# EAGLE schematic SimuRain_v2.2_Leonardo (EAGLE 9.2.2)
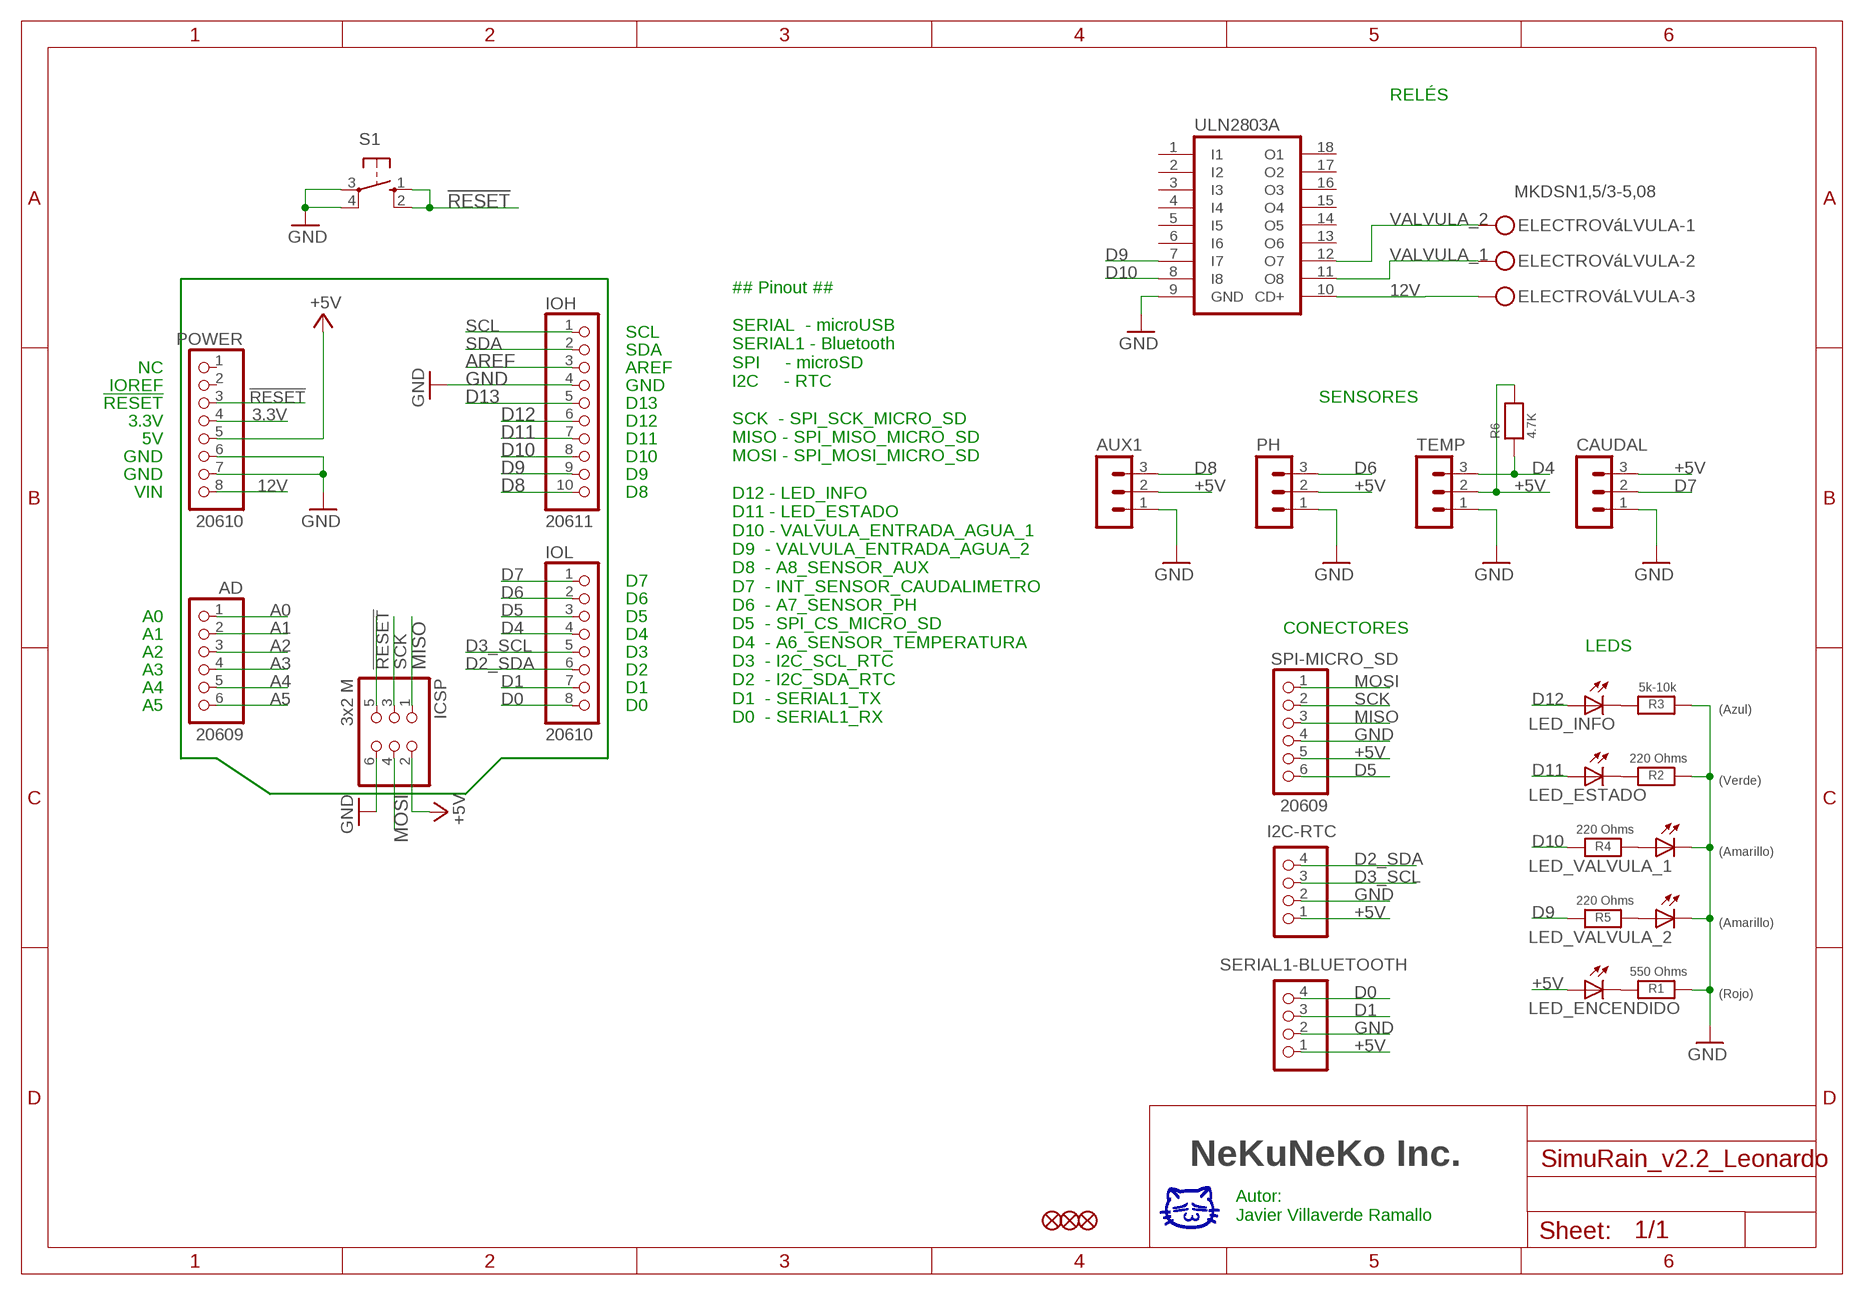
[diagram p0: schematic, sheet 1]

## Parts
AD  20609  HEADER-1X6OVALWAVE  [1X06_OVALWAVE]
AUX1  MA03-1  [MA03-1]
CAUDAL  MA03-1  [MA03-1]
ELECTROVáLVULA  MKDSN1,5/3-5,08  [MKDSN1,5/3-5,08]
FD1  FIDUCIAL_1MM  [FIDUCIAL_1MM]
FD2  FIDUCIAL_1MM  [FIDUCIAL_1MM]
FD3  FIDUCIAL_1MM  [FIDUCIAL_1MM]
I2C-RTC  HEADER-1X4  [1X04_OVAL]
ICSP  3x2 M  HEADER-2X3  [2X03_ROUND_70MIL]
IOH  20611  HEADER-1X10OVALWAVE  [1X10_OVALWAVE]
IOL  20610  HEADER-1X8OVALWAVE  [1X08_OVALWAVE]
LED_ENCENDIDO  LED5MM  [LED5MM]
LED_ESTADO  LED5MM  [LED5MM]
LED_INFO  LED5MM  [LED5MM]
LED_VALVULA_1  LED5MM  [LED5MM]
LED_VALVULA_2  LED5MM  [LED5MM]
PH  MA03-1  [MA03-1]
POWER  20610  HEADER-1X8OVALWAVE  [1X08_OVALWAVE]
R1  550 Ohms  RESISTOR_0805  [_0805]
R2  220 Ohms  RESISTOR_0805  [_0805]
R3  5k-10k  RESISTOR_0805  [_0805]
R4  220 Ohms  RESISTOR_0805  [_0805]
R5  220 Ohms  RESISTOR_0805  [_0805]
R6  4.7K  RESISTOR_0805  [_0805]
S1  10-XX  [B3F-10XX]
SERIAL1-BLUETOOTH  HEADER-1X4  [1X04_OVAL]
SPI-MICRO_SD  20609  HEADER-1X6OVALWAVE  [1X06_OVALWAVE]
TEMP  MA03-1  [MA03-1]
ULN2803A  ULN2803A  [DIL18]

## Nets
3.3V: POWER.4
12V: ELECTROVáLVULA.3 POWER.8 ULN2803A.10(CD+)
!RESET: ICSP.5 POWER.3 S1.1(S) S1.2(S1)
+5V [usbvcc]: AUX1.2 CAUDAL.3 I2C-RTC.1 ICSP.2 LED_ENCENDIDO.A PH.2 POWER.5 R6.2 SERIAL1-BLUETOOTH.1 SPI-MICRO_SD.5 TEMP.2
A0: AD.1
A1: AD.2
A2: AD.3
A3: AD.4
A4: AD.5
A5: AD.6
AREF [aref]: IOH.3
D0: IOL.8 SERIAL1-BLUETOOTH.4
D1: IOL.7 SERIAL1-BLUETOOTH.3
D2_SDA: I2C-RTC.4 IOL.6
D3_SCL: I2C-RTC.3 IOL.5
D4: IOL.4 R6.1 TEMP.3
D5: IOL.3 SPI-MICRO_SD.6
D6: IOL.2 PH.3
D7: CAUDAL.2 IOL.1
D8: AUX1.3 IOH.10
D9: IOH.9 R5.1 ULN2803A.7(I7)
D10: IOH.8 R4.1 ULN2803A.8(I8)
D11: IOH.7 LED_ESTADO.A
D12: IOH.6 LED_INFO.A
D13: IOH.5
GND [gnd]: AUX1.1 CAUDAL.1 I2C-RTC.2 ICSP.6 IOH.4 LED_VALVULA_1.K(C) LED_VALVULA_2.K(C) PH.1 POWER.6 POWER.7 R1.2 R2.2 R3.2 S1.3(P) S1.4(P1) SERIAL1-BLUETOOTH.2 SPI-MICRO_SD.4 TEMP.1 ULN2803A.9(GND)
MISO: ICSP.1 SPI-MICRO_SD.3
MOSI: ICSP.4 SPI-MICRO_SD.1
N$1: LED_VALVULA_2.A R5.2
N$2: LED_VALVULA_1.A R4.2
N$3: LED_ENCENDIDO.K(C) R1.1
N$4: LED_ESTADO.K(C) R2.1
N$5: LED_INFO.K(C) R3.1
SCK: ICSP.3 SPI-MICRO_SD.2
SCL: IOH.1
SDA: IOH.2
VALVULA_1: ELECTROVáLVULA.2 ULN2803A.11(O8)
VALVULA_2: ELECTROVáLVULA.1 ULN2803A.12(O7)
Unconnected: POWER.1 POWER.2 ULN2803A.1(I1) ULN2803A.2(I2) ULN2803A.3(I3) ULN2803A.4(I4) ULN2803A.5(I5) ULN2803A.6(I6) ULN2803A.13(O6) ULN2803A.14(O5) ULN2803A.15(O4) ULN2803A.16(O3) ULN2803A.17(O2) ULN2803A.18(O1)

## Notes on the sheet
- RELÉS
- SCL
- SDA
- NC | AREF
- IOREF | GND
- !RESET | D13 | SENSORES
- 3.3V | D12
- 5V | D11
- GND | D10
- GND | D9
- VIN | D8
- D7
- D6
- A0 | D5
- A1 | D4 | CONECTORES
- A2 | D3 | LEDS
- A3 | D2
- A4 | D1
- A5 | D0
- (Azul)
- ## Pinout ##
  
  SERIAL  - microUSB
  SERIAL1 - Bluetooth
  SPI     - microSD
  I2C     - RTC
  
  SCK  - SPI_SCK_MICRO_SD
  MISO - SPI_MISO_MICRO_SD
  MOSI - SPI_MOSI_MICRO_SD
  
  D12 - LED_INFO
  D11 - LED_ESTADO
  D10 - VALVULA_ENTRADA_AGUA_1
  D9  - VALVULA_ENTRADA_AGUA_2
  D8  - A8_SENSOR_AUX
  D7  - INT_SENSOR_CAUDALIMETRO
  D6  - A7_SENSOR_PH
  D5  - SPI_CS_MICRO_SD
  D4  - A6_SENSOR_TEMPERATURA
  D3  - I2C_SCL_RTC
  D2  - I2C_SDA_RTC
  D1  - SERIAL1_TX
  D0  - SERIAL1_RX
- (Verde)
- (Amarillo)
- (Amarillo)
- (Rojo)
- NeKuNeKo Inc.
- Autor:
  Javier Villaverde Ramallo

## Library data of the parts
AD SPI-MICRO_SD = microbuilder:HEADER-1X6: PIN HEADER
AUX1 CAUDAL PH TEMP = con-lstb:MA03-1: PIN HEADER; OC_FARNELL: unknown; OC_NEWARK: unknown
ELECTROVáLVULA = con-phoenix-508:MKDSN1,5/3-5,08: MKDSN 1,5/ 3-5,08 Printklemme Nennstrom: 13,5 A Nennspannung: 250 V Rastermaß: 5,08 mm Polzahl: 3 Anschlussart: Schraubanschluss Montage: Löten Anschlussrichtung Leiter/Platine: 0 ° Artikelnummer: 1729131 Source: http://eshop.phoenixcontact.com .. 1729131.pdf
FD1-FD3 = microbuilder:FIDUCIAL: Fiducial Alignment Points Various fiducial points for machine vision alignment.; BOM: EXCLUDE
I2C-RTC SERIAL1-BLUETOOTH = microbuilder:HEADER-1X4: PIN HEADER
ICSP = microbuilder:HEADER-2X3: PIN HEADER
IOH = microbuilder:HEADER-1X10: PIN HEADER
IOL POWER = microbuilder:HEADER-1X8: PIN HEADER
LED_ENCENDIDO LED_ESTADO LED_INFO LED_VALVULA_1 LED_VALVULA_2 = led:LED: LED OSRAM: - CHIPLED LG R971, LG N971, LY N971, LG Q971, LY Q971, LO R971, LY R971 LH N974, LH R974 LS Q976, LO Q976, LY Q976 LO Q996 - Hyper CHIPLED LW Q18S LB Q993, LB Q99A, LB R99A - SideLED LS A670, LO A670, LY A670, LG A670, LP A670 LB A673, LV A673, LT A673, LW A673 LH A674 LY A675 LS A676, LA A676, LO A676, LY A676, LW A676 LS A679, LY A679, LG A679 - Hyper Micro SIDELED® LS Y876, LA Y876, LO Y876, LY Y876 LT Y87S - SmartLED LW L88C, LW L88S LB L89C, LB L89S, LG L890 LS L89K, LO L89K, LY L89K LS L896, LA L896, LO L896, LY L896 - TOPLED LS T670, LO T670, LY T670, LG T670, LP T670 LSG T670, LSP T670, LSY T670, LOP T670, LYG T670 LG T671, LOG T671, LSG T671 LB T673, LV T673, LT T673, LW T673 LH T674 LS T676, LA T676, LO T676, LY T676, LB T676, LH T676, LSB T676, LW T676 LB T67C, LV T67C, LT T67C, LS T67K, LO T67K, LY T67K, LW E67C LS E67B, LA E67B, LO E67B, LY E67B, LB E67C, LV E67C, LT E67C LW T67C LS T679, LY T679, LG T679 LS T770, LO T770, LY T770, LG T770, LP T770 LB T773, LV T773, LT T773, LW T773 LH T774 LS E675, LA E675, LY E675, LS T675 LS T776, LA T776, LO T776, LY T776, LB T776 LHGB T686 LT T68C, LB T68C - Hyper Mini TOPLED® LB M676 - Mini TOPLED Santana® LG M470 LS M47K, LO M47K, LY M47K Source: http://www.osram.convergy.de LUXEON: - LUMILED® LXK2-PW12-R00, LXK2-PW12-S00, LXK2-PW14-U00, LXK2-PW14-V00 LXK2-PM12-R00, LXK2-PM12-S00, LXK2-PM14-U00 LXK2-PE12-Q00, LXK2-PE12-R00, LXK2-PE12-S00, LXK2-PE14-T00, LXK2-PE14-U00 LXK2-PB12-K00, LXK2-PB12-L00, LXK2-PB12-M00, LXK2-PB14-N00, LXK2-PB14-P00, LXK2-PB14-Q00 LXK2-PR12-L00, LXK2-PR12-M00, LXK2-PR14-Q00, LXK2-PR14-R00 LXK2-PD12-Q00, LXK2-PD12-R00, LXK2-PD12-S00 LXK2-PH12-R00, LXK2-PH12-S00 LXK2-PL12-P00, LXK2-PL12-Q00, LXK2-PL12-R00 Source: www.luxeon.com KINGBRIGHT: KA-3528ASYC Source: www.kingbright.com
R1-R6 = microbuilder:RESISTOR: Resistors 0402 - 0402 Surface Mount Package 22 Ohm 1% 1/16W [Digikey: 311-22.0LRTR-ND] 33 Ohm 5% 1/16W 1.0K 5% 1/16W 1.5K 5% 1/16W 2.0K 1% 1/16W 10.0K 1% 1/16W [Digikey: 311-10.0KLRTR-ND] 10.0K 5% 1/16W [Digikey: RMCF0402JT10K0TR-ND] 12.1K 1% 1/16W [Digikey: 311-22.0LRTR-ND] 100.0K 5% 1/16W 0603 - 0603 Surface Mount Package 0 Ohm 1/10 Watt 1% Resistor 15 Ohm 1/10 Watt 1% Resistor 33 Ohm 1/10 Watt 1% Resistor 49.9 Ohm 1/10 Watt 1% Resistor 100 Ohm 1/10 Watt 1% Resistor 150 Ohm 1/10 Watt 1% Resistor 240 Ohm 1/10 Watt 1% Resistor 390 Ohm 1/10 Watt 1% Resistor 560 Ohm 1/10 Watt 1% Resistor 680 Ohm 1/10 Watt 1% Resistor 750 Ohm 1/10 Watt 1% Resistor 1.0K Ohm 1/10 Watt 1% Resistor 1.5K Ohm 1/10 Watt 1% Resistor 2.0K Ohm 1/10 Watt 1% Resistor 2.2K Ohm 1/10 Watt 1% Resistor 3.3K Ohm 1/10 Watt 1% Resistor 4.7K Ohm 1/10 Watt 1% Resistor 10.0K Ohm 1/10 Watt 1% Resistor 12.0K Ohm 1/10 Watt 1% Resistor 12.1K Ohm 1/10 Watt 1% Resistor 20.0K Ohm 1/10 Watt 1% Resistor 33.0K Ohm 1/10 Watt 1% Resistor 100.0K Ohm 1/10 Watt 1% Resistor 0805 - 0805 Surface Mount Package 0 Ohm 1/8 Watt 1% Resistor 33 Ohm 1/8 Watt 1% Resistor 100 Ohm 1/8 Watt 1% Resistor 150 Ohm 1/8 Watt 1% Resistor 200 Ohm 1/8 Watt 1% Resistor 240 Ohm 1/8 Watt 1% Resistor 330 Ohm 1/8 Watt 1% Resistor 390 Ohm 1/8 Watt 1% Resistor 470 Ohm 1/8 Watt 1% Resistor 1.0K Ohm 1/8 Watt 1% Resistor 1.5K Ohm 1/8 Watt 1% Resistor 2.0K Ohm 1/8 Watt 1% Resistor 4.7K Ohm 1/8 Watt 1% Resistor 5.1K Ohm 1/8 Watt 1% Resistor 5.6K Ohm 1/8 Watt 1% Resistor 10.0K Ohm 1/8 Watt 1% Resistor 22.0K Ohm 1/8 Watt 1% Resistor 33.0K Ohm 1/8 Watt 1% Resistor 100K Ohm 1/8 Watt 1% Resistor 1206 - 1206 Surface Mount Package 2012 - 2010 Surface Mount Package 0.11 Ohm 1/2 Watt 1% Resistor - Digikey: RHM.11UCT-ND
S1 = switch-omron:10-XX: OMRON SWITCH; MPN: B3F-1000; OC_FARNELL: 176432; OC_NEWARK: 36M3542
ULN2803A = uln-udn:ULN2803A: DRIVER ARRAY